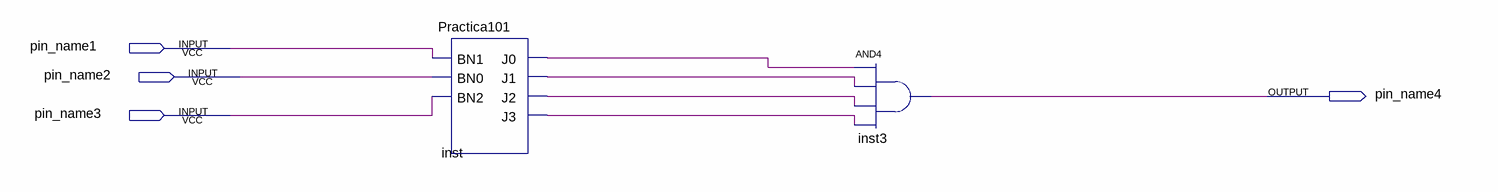
[diagram p0: schematic sheet]
// Quartus schematic Block2.bdf as structural Verilog: 2 symbols, 4 pins
module Block2 (
  input  pin_name1,
  input  pin_name2,
  input  pin_name3,
  output pin_name4
);

  wire inst_j0, inst_j1, inst_j2, inst_j3;

  Practica101 inst (
    .BN1(pin_name1), .BN0(pin_name2), .BN2(pin_name3), .J0(inst_j0), .J1(inst_j1), .J2(inst_j2), .J3(inst_j3));
  and inst3 (pin_name4, inst_j0, inst_j1, inst_j2, inst_j3);
endmodule
